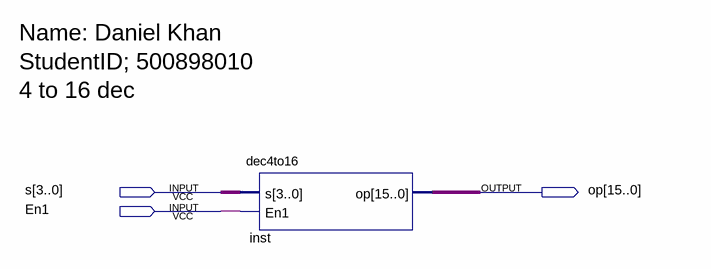
[diagram p0: schematic sheet]
// Quartus schematic TEST4to16.bdf as structural Verilog: 1 symbols, 3 pins
module TEST4to16 (
  input  [3:0] s,
  input  En1,
  output [15:0] op
);

  dec4to16 inst (.s(s), .En1(En1), .op(op));

  // Notes on the sheet:
  //   Name: Daniel Khan
  //   StudentID; 500898010
  //   4 to 16 dec
endmodule
